# EAGLE design untitled (EAGLE 7.2.0)
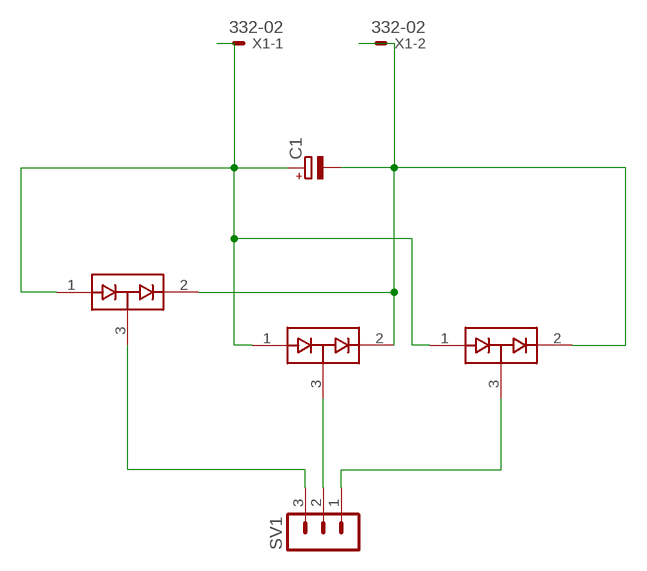
[diagram p0: schematic, sheet 1]

## Parts
C1  CPOL-EUE2-5  [E2-5]
D1  BAV99  [SOT23-3]
D2  BAV99  [SOT23-3]
D3  BAV99  [SOT23-3]
SV1  MA03-1  [MA03-1]
X1  332-02  [332-02]

## Nets
N$1: D1.3(COM) SV1.3
N$2: D2.3(COM) SV1.2
N$3: D3.3(COM) SV1.1
N$4: C1.+ D1.1(A1) D2.1(A1) D3.1(A1) X1.1
N$6: C1.- D1.2(C2) D2.2(C2) D3.2(C2) X1.2

## Library data of the parts
C1 = rcl:CPOL-EU: POLARIZED CAPACITOR, European symbol
D1-D3 = SparkFun-DiscreteSemi:BAV99: Two small signal silicon diodes connected anode to cathode. Connections to all three nodes available. DIO-10647; PROD_ID: DIO-10647
SV1 = con-lstb:MA03-1: PIN HEADER; OC_FARNELL: unknown; OC_NEWARK: unknown
X1 = con-garry:332-02: 2 Pin - 2mm Dual Row Source: www.mpe-connector.de / garry_shortform_2012.pdf

## Board
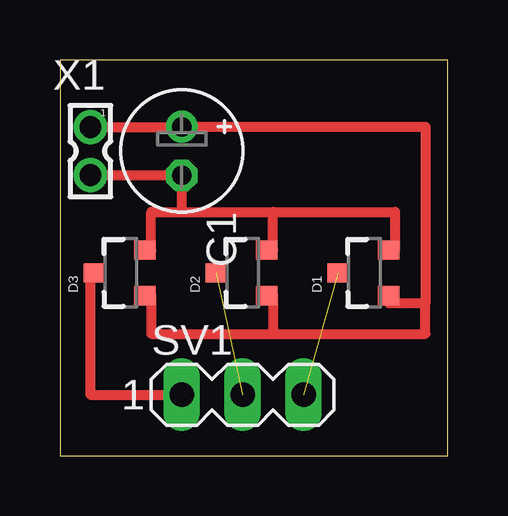
[diagram p1: board, top side]

Size 16.18 x 16.5 mm. Coordinates in mm from the lower left corner, seen from the top.
Outline: 0,0 16.18,0 16.18,16.5 0,16.5 0,0
Copper layers (1*16): Top 0.035mm / dielectric 1.5mm / Bottom 0.035mm
Design rules "default": minimum track width 10mil, minimum drill 24mil, track to track 8mil, track to pad 8mil, pad to pad 8mil, via to via 8mil, smd to smd 8mil, copper to edge 40mil, drill to drill 8mil, minimum pad ring 10mil, minimum via ring 8mil, stop-mask expansion 4mil, vias tented up to drill 0mil, thermal gap 10mil

### Footprints (pad centres in the part's own frame; a part is rotated, then mirrored left to right if it is on the bottom)
E2-5 = drill 0.813 pad 1.27: + -1.016,0 | drill 0.813 pad 1.27 octagon: - 1.016,0
SOT23-3 = smd 0.8 x 0.9: 1 -0.95,-1; 2 0.95,-1; 3 0,1.1
MA03-1 = drill 1.016 long: 1 -2.54,0; 2 0,0; 3 2.54,0
332-02 = drill 0.9 pad 1.27: 1 0,-1; 2 0,1

### Placement (x,y rotation side)
C1  5.08,12.7 270 top
D1  12.7,7.62 90 top
D2  7.62,7.62 90 top
D3  2.54,7.62 90 top
SV1  7.62,2.54 0 top
X1  1.27,12.7 180 top

### Tracks (layer width: path | path; a pad name or v marks a point on that pad's centre or on a via)
N$1  (1 unrouted)
N$2  (1 unrouted)
N$3
  Top 0.406: D3.3 1.27,7.62 1.27,2.54 SV1.1
N$4
  Top 0.406: D3.1 3.81,6.67 3.81,5.08 8.89,5.08 | 8.89,5.08 15.24,5.08 15.24,6.35 | 15.24,6.35 13.7,6.35 D1.1 | D2.1 8.89,6.67 8.89,5.08 | 15.24,6.35 15.24,13.72 C1.+ 5.08,13.7 X1.1
N$6
  Top 0.406: D3.2 3.81,8.57 3.81,10.16 5.08,10.16 | 5.08,10.16 8.89,10.16 | 8.89,10.16 13.97,10.16 13.97,8.57 D1.2 | D2.2 8.89,8.57 8.89,10.16 | 5.08,10.16 C1.- 5.08,11.7 X1.2